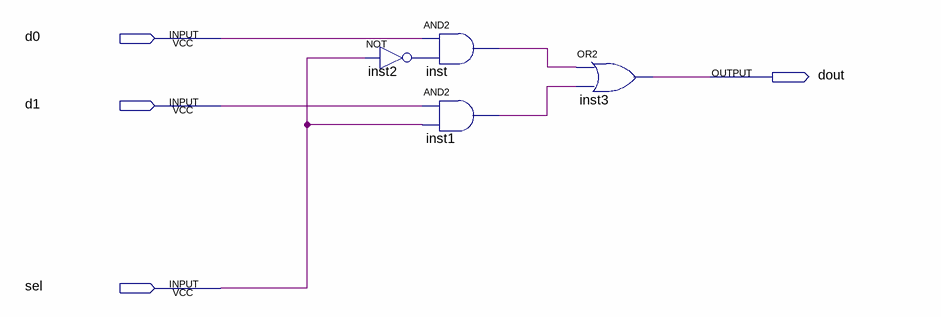
[diagram p0: schematic sheet]
// Quartus schematic Mux1bit2x1.bdf as structural Verilog: 4 symbols, 4 pins
module Mux1bit2x1 (
  input  d0,
  input  d1,
  input  sel,
  output dout
);

  wire inst1_out, inst2_out, inst_out;

  not inst2 (inst2_out, sel);
  and inst (inst_out, d0, inst2_out);
  and inst1 (inst1_out, d1, sel);
  or inst3 (dout, inst_out, inst1_out);
endmodule
